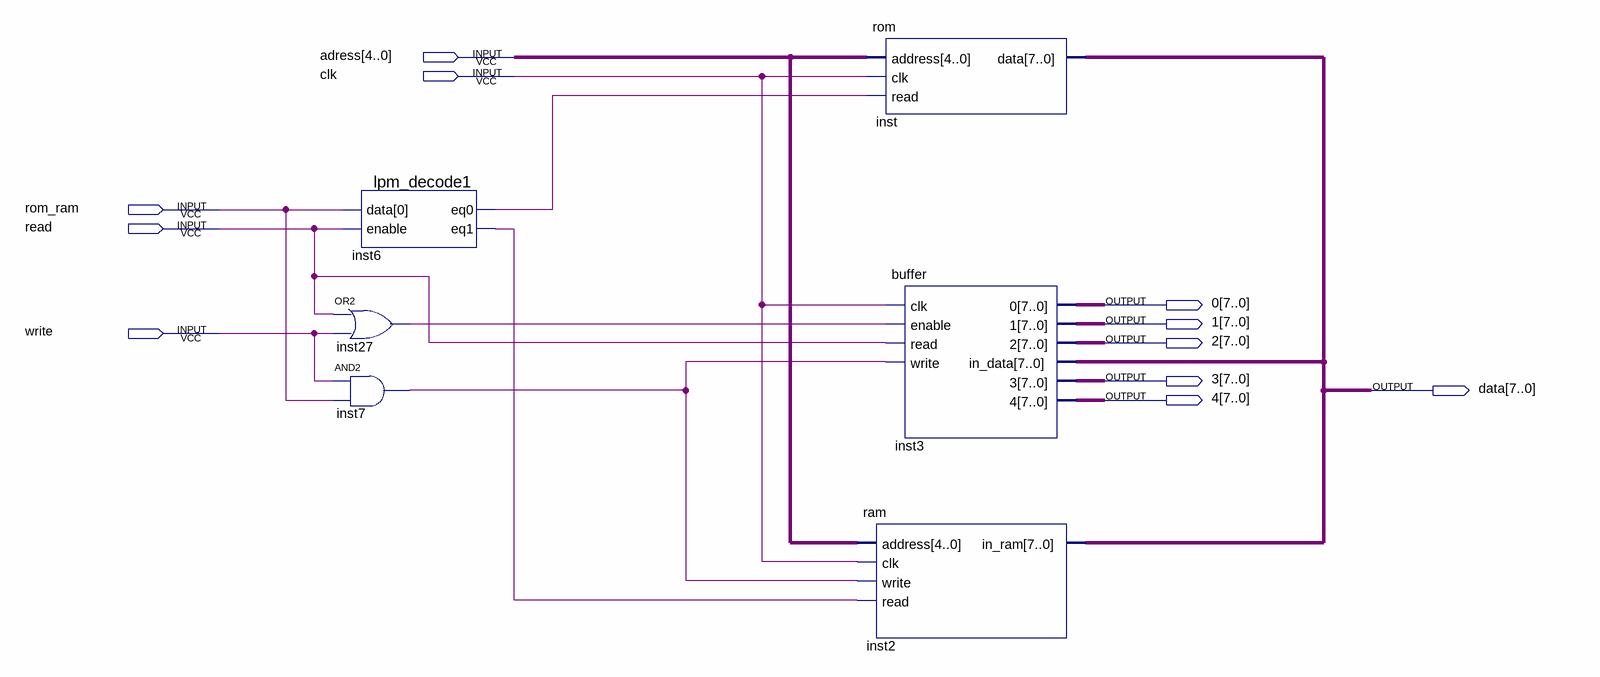
[diagram p0: schematic sheet]
// Quartus schematic main.bdf as structural Verilog: 6 symbols, 11 pins
module main (
  input  [4:0] adress,
  input  clk,
  input  rom_ram,
  input  read,
  input  write,
  output [7:0] \0 ,
  output [7:0] \1 ,
  output [7:0] \2 ,
  output [7:0] \3 ,
  output [7:0] data,
  output [7:0] \4 
);

  wire inst6_eq0, inst6_eq1, inst7_out, inst27_out;

  lpm_decode1 inst6 (.data(rom_ram), .enable(read), .eq0(inst6_eq0), .eq1(inst6_eq1));
  or inst27 (inst27_out, read, write);
  and inst7 (inst7_out, write, rom_ram);
  ram inst2 (.address(adress), .clk(clk), .write(inst7_out), .read(inst6_eq1), .in_ram(data));
  rom inst (.address(adress), .clk(clk), .read(inst6_eq0), .data(data));
  buffer inst3 (
    .clk(clk), .enable(inst27_out), .read(read), .write(inst7_out), .\0 (\0 ), .\1 (\1 ), .\2 (\2 ),
    .\3 (\3 ), .\4 (\4 ), .in_data(data));
endmodule
